# Altium schematic sheet Schematic.SchDoc
size Tabloid; Organization: Altium Limited; Address1: L3, 12a Rodborough Rd; Address2: Frenchs Forest; Address3: NSW; Address4: Australia 2086
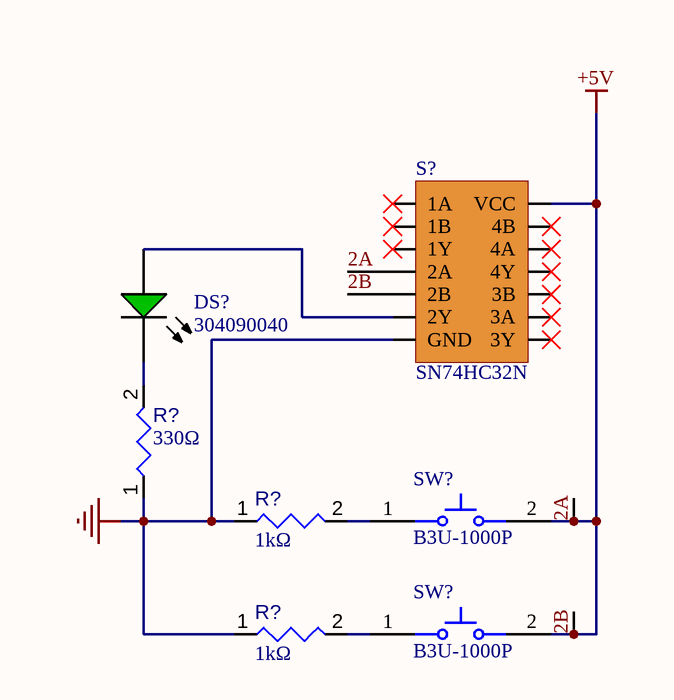
[diagram p0: Schematic.SchDoc]

## Parts
(Parts that share a designator on the sheet are numbered #1, #2 ... from top to bottom, then left to right.)
DS?  304090040  [LED-2P-2.28-3MM]
R?#1  value 330Ω  [RESC0402(1005)_L]  (hidden comment: 330R2J)
R?#2  value 1kΩ  [RESC0402(1005)_L]  (hidden comment: 1KR2J)
R?#3  value 1kΩ  [RESC0402(1005)_L]  (hidden comment: 1KR2J)
S?  SN74HC32N
SW?#1  B3U-1000P  [OMRON-B3U-1000_V]
SW?#2  B3U-1000P  [OMRON-B3U-1000_V]

## Nets
2A: S?.4(2A) S?.5(2B) S?.14(VCC) SW?#1.2 SW?#2.2  [also labelled +5V, 2B]
GND: R?#1.1 R?#2.1 R?#3.1 S?.7(GND)
NetDS?_1: DS?.1(A) S?.6(2Y)
NetDS?_2: DS?.2(K) R?#1.2
NetR?#2_2: R?#2.2 SW?#1.1
NetR?#3_2: R?#3.2 SW?#2.1

Not connected (* = marked no-connect by the designer): S? 1(1A)* 2(1B)* 3(1Y)* 8(3Y)* 9(3A)* 10(3B)* 11(4Y)* 12(4A)* 13(4B)*

## Notes on the sheet
- Title
- Size:
- Date:
- Tabloid
- Number:
- Time:
- Revision:
- Sheet
- of
- File:

## Library data of the parts
DS? = CMP-007-00006-1: Green LED, 80 mW, 20 mA, -25 to 85 degC, 2-Pin THD; Manufacturer: Shenzhen CGX; Mounting Technology: TH; Case/Package: 304090040; Package Description: 2-Pin Through Hole Device, Dia 3 mm, Pitch 2.28 mm; RoHS Compliant: Unknown; Package Reference: 304090040; Datasheet Version: Rev. 1.0, 09/2014; Manufacturer URL: http://szcgx.com/; Datasheet URL: http://datasheet.octopart.com/304090040-Chengguangxing-datasheet-62330655.pdf
R?#1 = CMP-009-00095-1: 330R 0.063W 5% 0402 (1005 Metric)  SMD; Power: 63mW; Mounting Technology: SMT; Pins: 2; Tolerance: 5%; Case/Package: 0402
R?#2 R?#3 = CMP-009-00075-1: 1K 0.063W 5% 0402 (1005 Metric)  SMD; Power: 63mW; Pins: 2; Mounting Technology: SMT; Tolerance: 5%; Case/Package: 0402
SW?#1 SW?#2 = CMP-011-00000-1: Tactile Switch, SPST-NO, 0.05 A, 12 V, -25 to 70 degC, 2-Pin SMD, RoHS, Tape and Reel; Manufacturer: Omron Electronic Components; Contact Current Rating: 50mA; Max Voltage Rating (DC): 12V; Resistance: 0.1Ohm; Max Contact Resistance: 100mohm; Throw Configuration: SPST; Operating Force: 153gf; IP Rating: IP40; Min Operating Temperature: -25°C; RoHS Compliant: True; Package Description: 2-Pin Surface Mount Device, Body 3 x 2.5 mm; Packaging: TapeandReel; Package Reference: B3U-1000; Datasheet URL: http://www.omron.com/ecb/products/pdf/en-b3u.pdf; Contact Material: Silver; Max Current Rating: 50mA; Max Operating Temperature: 70°C; Voltage Rating: 12V; Voltage Rating (DC): 12V; Datasheet Version: Jan-15; Manufacturer URL: http://www.omron.com/; Current Rating: 50mA; Case/Package: B3U-1000; Package Quantity: 3500; Mounting Technology: SM